# Altium schematic sheet U_powder.SchDoc
size A4; SheetNumber: 2; SheetTotal: 3
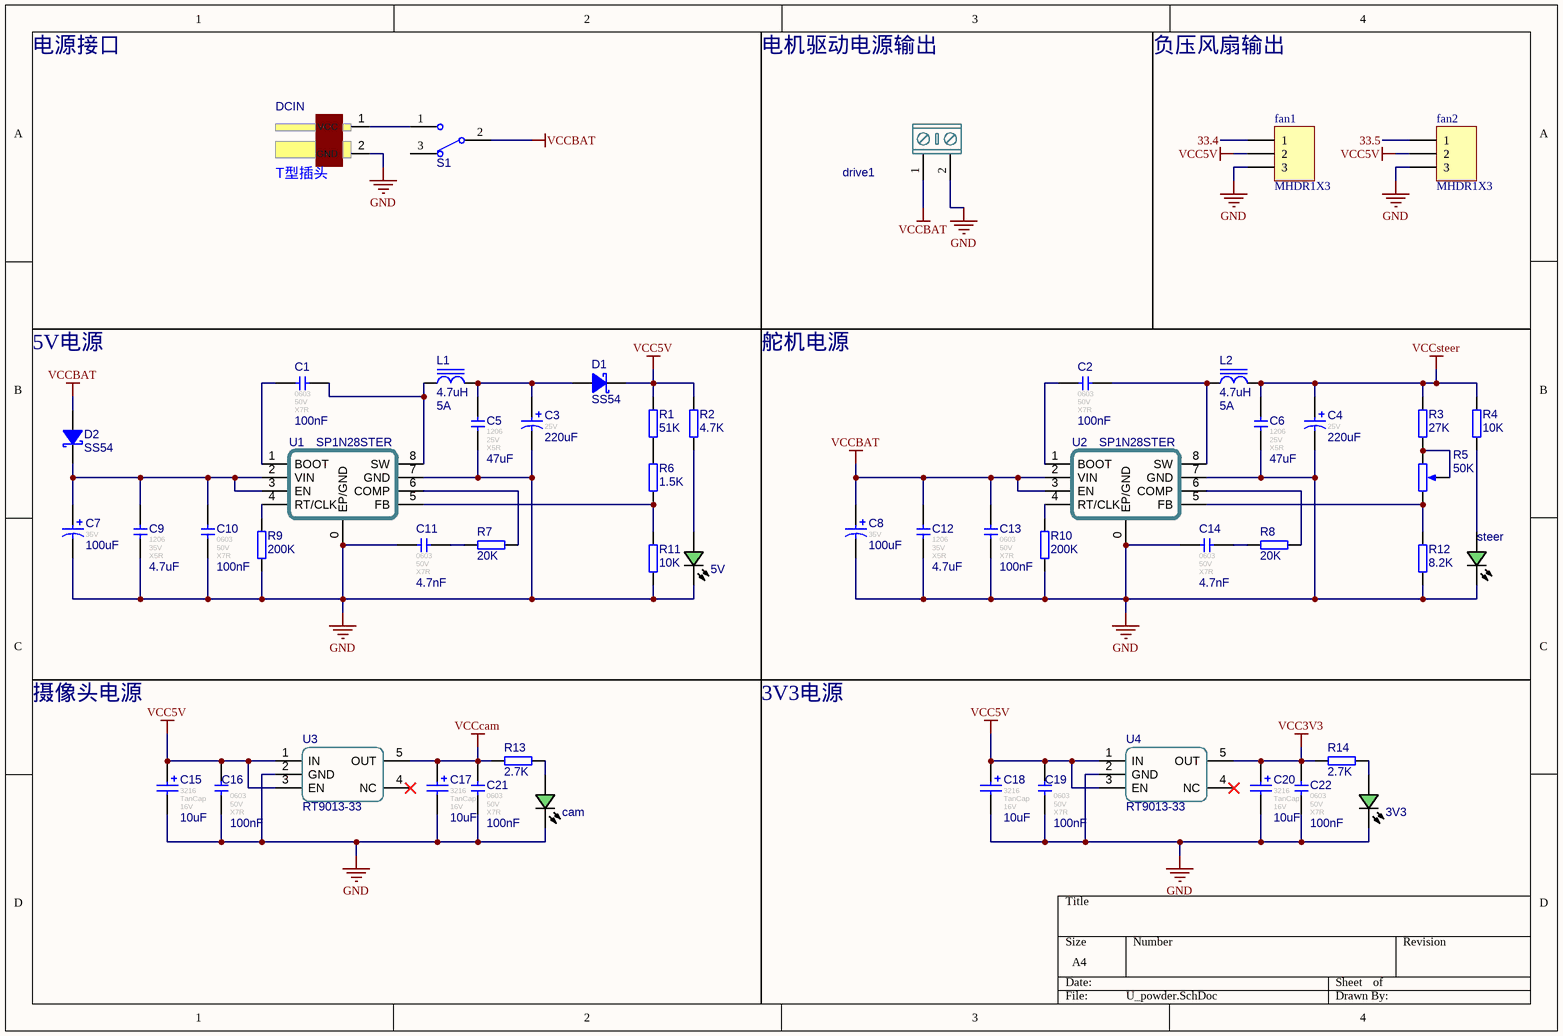
[diagram p0: U_powder.SchDoc]

## Parts
3V3  翠绿贴片LED  [LEDC1608(0603)-L]  (value not drawn)
5V  翠绿贴片LED  [LEDC1608(0603)-L]  (value not drawn)
C1  value 100nF  FootPrint: 0603  Voltage: 50V  Type: X7R  [CAPC1608[0603]S-N]  (hidden comment: 100nF 50V X7R)
C2  value 100nF  FootPrint: 0603  Voltage: 50V  Type: X7R  [CAPC1608[0603]S-N]  (hidden comment: 100nF 50V X7R)
C3  value 220uF  Voltage: 25V  [CAP-E-S 6.3]  (hidden comment: 220uF 25V 铝电解)
C4  value 220uF  Voltage: 25V  [CAP-E-S 6.3]  (hidden comment: 220uF 25V 铝电解)
C5  value 47uF  FootPrint: 1206  Voltage: 25V  Type: X5R  [CAPC3216[1206]S]  (hidden comment: 47uF 25V X5R)
C6  value 47uF  FootPrint: 1206  Voltage: 25V  Type: X5R  [CAPC3216[1206]S]  (hidden comment: 47uF 25V X5R)
C7  value 100uF  Voltage: 35V  [CAP-E-S 6.3]  (hidden comment: 100uF 35V 铝电解)
C8  value 100uF  Voltage: 35V  [CAP-E-S 6.3]  (hidden comment: 100uF 35V 铝电解)
C9  value 4.7uF  FootPrint: 1206  Voltage: 35V  Type: X5R  [CAPC3216[1206]S]  (hidden comment: 4.7uF 35V X5R)
C10  value 100nF  FootPrint: 0603  Voltage: 50V  Type: X7R  [CAPC1608[0603]S-N]  (hidden comment: 100nF 50V X7R)
C11  value 4.7nF  FootPrint: 0603  Voltage: 50V  Type: X7R  [CAPC1608[0603]S-N]  (hidden comment: 4.7nF 50V X7R)
C12  value 4.7uF  FootPrint: 1206  Voltage: 35V  Type: X5R  [CAPC3216[1206]S]  (hidden comment: 4.7uF 35V X5R)
C13  value 100nF  FootPrint: 0603  Voltage: 50V  Type: X7R  [CAPC1608[0603]S-N]  (hidden comment: 100nF 50V X7R)
C14  value 4.7nF  FootPrint: 0603  Voltage: 50V  Type: X7R  [CAPC1608[0603]S-N]  (hidden comment: 4.7nF 50V X7R)
C15  value 10uF  FootPrint: 3216  Type: TanCap  Voltage: 16V  [CAP-T-S 3216]  (hidden comment: 10uF 16V 钽电容)
C16  value 100nF  FootPrint: 0603  Voltage: 50V  Type: X7R  [CAPC1608[0603]S-N]  (hidden comment: 100nF 50V X7R)
C17  value 10uF  FootPrint: 3216  Type: TanCap  Voltage: 16V  [CAP-T-S 3216]  (hidden comment: 10uF 16V 钽电容)
C18  value 10uF  FootPrint: 3216  Type: TanCap  Voltage: 16V  [CAP-T-S 3216]  (hidden comment: 10uF 16V 钽电容)
C19  value 100nF  FootPrint: 0603  Voltage: 50V  Type: X7R  [CAPC1608[0603]S-N]  (hidden comment: 100nF 50V X7R)
C20  value 10uF  FootPrint: 3216  Type: TanCap  Voltage: 16V  [CAP-T-S 3216]  (hidden comment: 10uF 16V 钽电容)
C21  value 100nF  FootPrint: 0603  Voltage: 50V  Type: X7R  [CAPC1608[0603]S-N]  (hidden comment: 100nF 50V X7R)
C22  value 100nF  FootPrint: 0603  Voltage: 50V  Type: X7R  [CAPC1608[0603]S-N]  (hidden comment: 100nF 50V X7R)
cam  翠绿贴片LED  [LEDC1608(0603)-L]  (value not drawn)
D1  SS54  [SMA-L[DO-214AC]]
D2  SS54  [SMA-L[DO-214AC]]
DCIN  T型插头  [Wired T-Header ThroughHole]
drive1  KF/WJ/DG 30x connecter  [KF/WJ/DG 301-2p-5.0mm]  (value not drawn)
fan1  MHDR1X3  [MHDR1X3]
fan2  MHDR1X3  [MHDR1X3]
L1  value 4.7uH  Imax: 5A  [LLL]  (hidden comment: 4.7uH 5A)
L2  value 4.7uH  Imax: 5A  [LLL]  (hidden comment: 4.7uH 5A)
R1  value 51K  [RESC1608[0603]S-N]  (hidden comment: 51K ±1%)
R2  value 4.7K  [RESC1608[0603]S-N]  (hidden comment: 4.7K ±1%)
R3  value 27K  [RESC1608[0603]S-N]  (hidden comment: 27K ±1%)
R4  value 10K  [RESC1608[0603]S-N]  (hidden comment: 10K ±1%)
R5  50K  [RESPOT3296W]
R6  value 1.5K  [RESC1608[0603]S-N]  (hidden comment: 1.5K ±1%)
R7  value 20K  [RESC1608[0603]S-N]  (hidden comment: 20K ±1%)
R8  value 20K  [RESC1608[0603]S-N]  (hidden comment: 20K ±1%)
R9  value 200K  [RESC1608[0603]S-N]  (hidden comment: 200K ±1%)
R10  value 200K  [RESC1608[0603]S-N]  (hidden comment: 200K ±1%)
R11  value 10K  [RESC1608[0603]S-N]  (hidden comment: 10K ±1%)
R12  value 8.2K  [RESC1608[0603]S-N]  (hidden comment: 8.2K ±1%)
R13  value 2.7K  [RESC1608[0603]S-N]  (hidden comment: 2.7K ±1%)
R14  value 2.7K  [RESC1608[0603]S-N]  (hidden comment: 2.7K ±1%)
S1  SW-SPDT  [SS12D10]  (value not drawn)
steer  翠绿贴片LED  [LEDC1608(0603)-L]  (value not drawn)
U1  SP1N28STER  [SOP-8E]
U2  SP1N28STER  [SOP-8E]
U3  RT9013-33  [SOT-23-5]
U4  RT9013-33  [SOT-23-5]

## Nets
GND: 3V3.C 5V.C C3.2 C4.2 C5.1 C6.1 C7.2 C8.2 C9.1 C10.1 C11.1 C12.1 C13.1 C14.1 C15.2 C16.1 C17.2 C18.2 C19.1 C20.2 C21.2 C22.2 cam.C DCIN.2(GND) drive1.2 fan1.3 fan2.3 R9.1 R10.1 R11.1 R12.1 steer.C U1.0(EP/GND) U1.7(GND) U2.0(EP/GND) U2.7(GND) U3.2(GND) U4.2(GND)
VCC3V3: C20.1 C22.1 R14.1 U4.5(OUT)
VCC5V: C15.1 C16.2 C18.1 C19.2 D1.K fan1.2 fan2.2 R1.2 R2.2 U3.1(IN) U3.3(EN) U4.1(IN) U4.3(EN)
VCCBAT: C8.1 C12.2 C13.2 D2.A drive1.1 S1.2 U2.2(VIN) U2.3(EN)
VCCcam: C17.1 C21.1 R13.1 U3.5(OUT)
VCCsteer: C4.1 C6.2 L2.2 R3.2 R4.2
33.4: fan1.1
33.5: fan2.1
Net3V3_A: 3V3.A R14.2
Net5V_A: 5V.A R2.1
NetC1_1: C1.1 U1.1(BOOT)
NetC1_2: C1.2 L1.1 U1.8(SW)
NetC2_1: C2.1 U2.1(BOOT)
NetC2_2: C2.2 L2.1 U2.8(SW)
NetC3_1: C3.1 C5.2 D1.A L1.2
NetC7_1: C7.1 C9.2 C10.2 D2.K U1.2(VIN) U1.3(EN)
NetC11_2: C11.2 R7.1
NetC14_2: C14.2 R8.1
Netcam_A: cam.A R13.2
NetDCIN_1: DCIN.1(VCC) S1.1
NetR1_1: R1.1 R6.2
NetR3_1: R3.1 R5.2(BOT) R5.ADJ
NetR4_1: R4.1 steer.A
NetR5_1: R5.1(TOP) R12.2 U2.5(FB)
NetR6_1: R6.1 R11.2 U1.5(FB)
NetR7_2: R7.2 U1.6(COMP)
NetR8_2: R8.2 U2.6(COMP)
NetR9_2: R9.2 U1.4(RT/CLK)
NetR10_2: R10.2 U2.4(RT/CLK)

Not connected (* = marked no-connect by the designer): S1 3; U3 4(NC)*; U4 4(NC)*

## Notes on the sheet
- 电源接口
- 电机驱动电源输出
- 负压风扇输出
- 5V电源
- 舵机电源
- 摄像头电源
- 3V3电源

## Library data of the parts
3V3 5V cam steer = LED Chip Green: Published: 8-Jun-2000; Revision: July-2002: Re-released for DXP Platform.; Publisher: Altium Limited; Price(RMB): 0.00
C1 C2 C10 C13 C16 C19 C21 C22 = 100nF 0603 50V X7R: 贴片瓷片电容; MLCC; 0603(1608);; Revision: V1.0
C3 C4 = E-S 220uF 25V 6.3x7.7: 贴片电解电容 220uF 25V 6.3x7.7; Revision: V1.0; Type: 铝电解
C5 C6 = 47uF 1206 25V X5R: 贴片瓷片电容; MLCC; 1206(3216);; Revision: V1.0
C7 C8 = E-S 100uF 35V 6.3x7.7: 贴片电解电容 100uF 35V 6.3x7.7; Revision: V1.0; Type: 铝电解
C9 C12 = 4.7uF 1206 35V X5R: 贴片瓷片电容; MLCC; 1206(3216);; Revision: V1.0
C11 C14 = 4.7nF 0603 50V X7R: 贴片瓷片电容; MLCC; 0603(1608);; Revision: V1.0
C15 C17 C18 C20 = T-S 10uF 3216 16V: 贴片钽电容 10uF 3216 16V; Revision: July-2002: Re-released for DXP Platform.
D1 D2 = SS54: SS54 肖特基二极管; Revision: V1.0; Value: SS54
DCIN = T_Header
drive1 = KF/WJ/DG 30x: 接线端子 2Pin
fan1 fan2 = MHDR1X3: Header, 3-Pin; LatestRevisionDate: 17-Jul-2002; LatestRevisionNote: Re-released for DXP Platform.; Publisher: Altium Limited
L1 L2 = Ind-Power: 功率电感; DCR: .5m; Published: 8-Jun-2000; Revision: July-2002: Re-released for DXP Platform.; Publisher: Altium Limited; Price(RMB): 0.000
R1 = Res-Chip_2: 贴片电阻; Power: 1/8W; Revision: V1.0; Tolerance: ±1%
R2 = Res-Chip_3: 贴片电阻; Power: 1/8W; Revision: V1.0; Tolerance: ±1%
R3 = Res-Chip_7: 贴片电阻; Power: 1/8W; Revision: V1.0; Tolerance: ±1%
R4 R11 = Res-Chip: 贴片电阻; Power: 1/8W; Revision: V1.0; Tolerance: ±1%
R5 = Res-Adj-3p: 可调电阻; Revision: V1.0; Value: 50K
R6 = Res-Chip_5: 贴片电阻; Power: 1/8W; Revision: V1.0; Tolerance: ±1%
R7 R8 = Res-Chip_4: 贴片电阻; Power: 1/8W; Revision: V1.0; Tolerance: ±1%
R9 R10 = Res-Chip_1: 贴片电阻; Power: 1/8W; Revision: V1.0; Tolerance: ±1%
R12 = Res-Chip_8: 贴片电阻; Power: 1/8W; Revision: V1.0; Tolerance: ±1%
R13 R14 = Res-Chip_6: 贴片电阻; Power: 1/8W; Revision: V1.0; Tolerance: ±1%
S1 = SW-SPDT: 单刀双掷开关 3脚船型、钮子、拨动开关 SPDT Subminiature Toggle Switch; Published: 24-Mar-1999; Publisher: Altium Limited; Price(RMB): 0.000
U3 U4 = RT9013-33: 3.3V 500mA SOT-23-5 LDO
U1 U2 = SP1N28STER: Revision: V1.0; Value: SP1N28STER